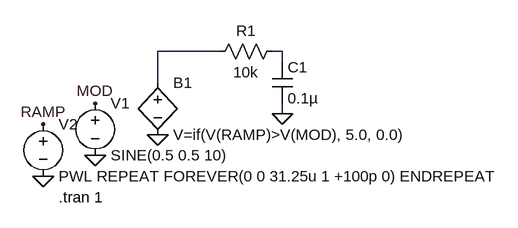
[diagram p0: schematic tsunami output modulation.asc]
tsunami output modulation.asc, the LTspice schematic file:
Version 4
SHEET 1 880 680
WIRE 64 192 -32 192
WIRE 160 192 144 192
WIRE 160 208 160 192
WIRE -32 240 -32 192
WIRE 160 288 160 272
FLAG 160 288 0
FLAG -32 320 0
FLAG -128 352 0
FLAG -208 384 0
FLAG -208 304 RAMP
FLAG -128 272 MOD
SYMBOL res 160 176 R90
WINDOW 0 0 56 VBottom 2
WINDOW 3 32 56 VTop 2
SYMATTR InstName R1
SYMATTR Value 10k
SYMBOL cap 144 208 R0
SYMATTR InstName C1
SYMATTR Value 0.1µ
SYMBOL bv -32 224 R0
SYMATTR InstName B1
SYMATTR Value V=if(V(RAMP)>V(MOD), 5.0, 0.0)
SYMBOL voltage -128 256 R0
SYMATTR InstName V1
SYMATTR Value SINE(0.5 0.5 10)
SYMBOL voltage -208 288 R0
SYMATTR InstName V2
SYMATTR Value PWL REPEAT FOREVER(0 0 31.25u 1 +100p 0) ENDREPEAT
TEXT -184 416 Left 2 !.tran 1

The netlist it stands for:
* tsunami output modulation.asc
R1 N002 N001 10k
C1 N002 0 0.1µ
B1 N001 0 V=if(V(RAMP)>V(MOD), 5.0, 0.0)
V1 MOD 0 SINE(0.5 0.5 10)
V2 RAMP 0 PWL REPEAT FOREVER(0 0 31.25u 1 +100p 0) ENDREPEAT
.tran 1
.backanno
.end